# Altium project VM03_hv2.PrjPcb
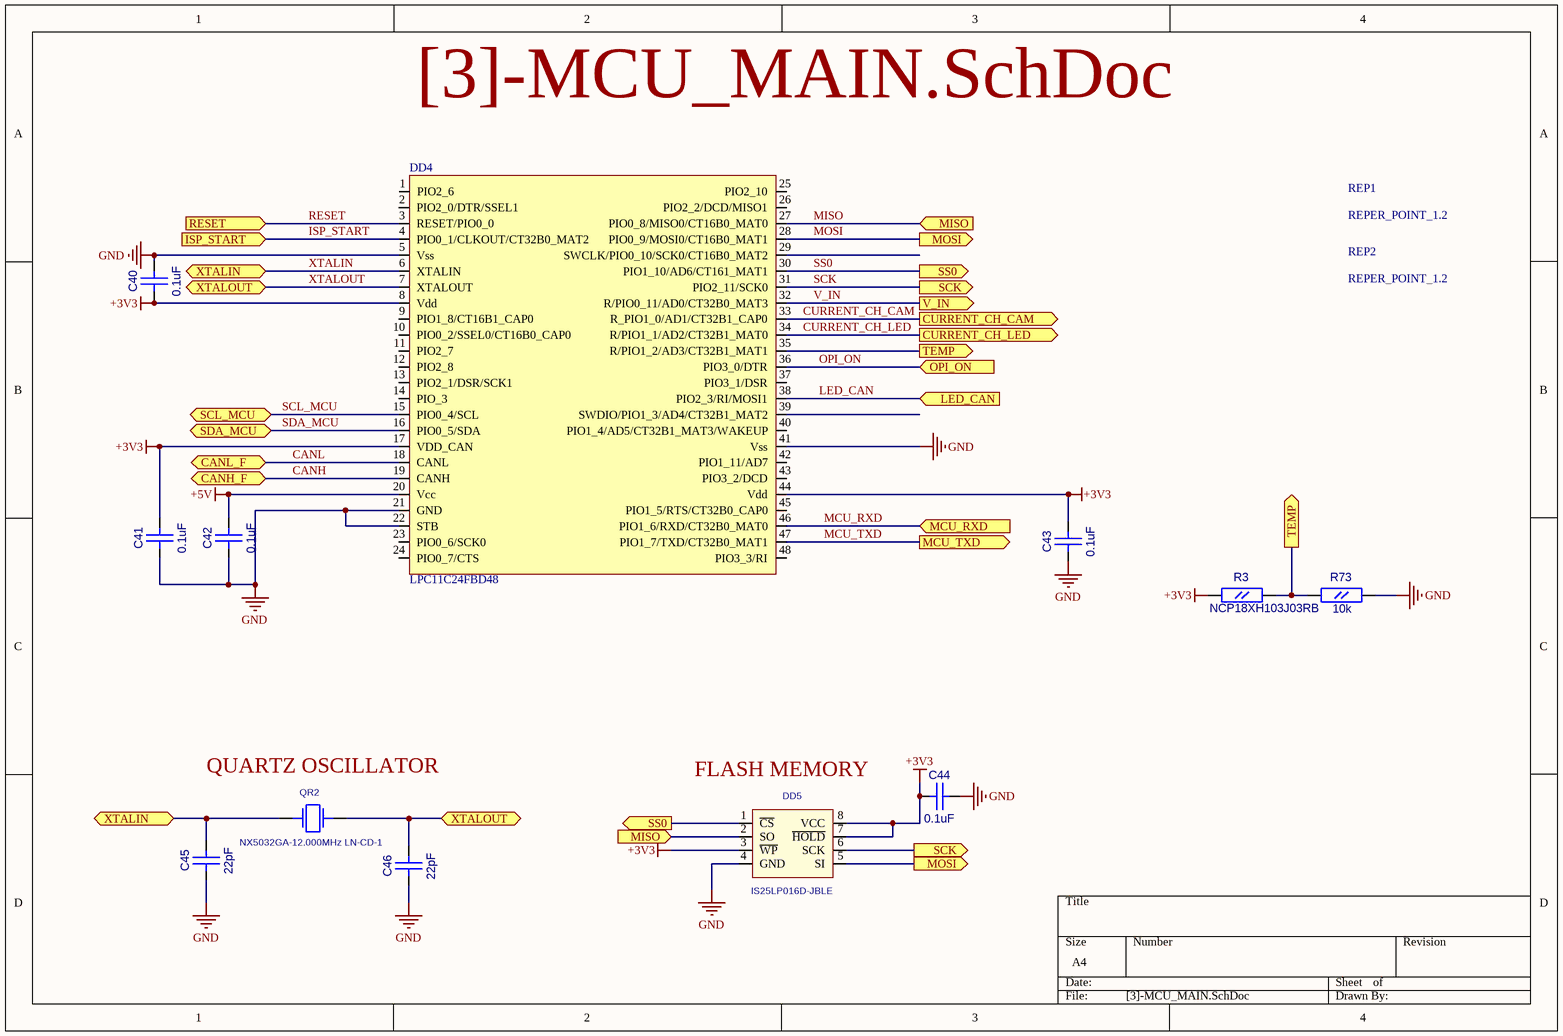
[diagram p0: [3]-MCU_MAIN.SchDoc]
13 sheets, 178 parts. Net scope: flat (ports and power ports of the same name join across sheets).
Board file: VM03_hv2.PcbDoc
Sheets:
  [3]-MCU_MAIN.SchDoc
  [5]-OPI_MAIN.SchDoc
  [6]-OPI_POWER.SchDoc
  [7]-GSM_MODEM_MAIN.SchDoc
  [8]-GSM_MODEM_CONNECTORS.SchDoc
  [9]-CAMERA_POWER_CONTROLLER.SchDoc
  [10]-MAIN_POWER.SchDoc
  [11]-MAIN_POWER2.SchDoc
  [11]-BATTERY_BACKUP.SchDoc
  [12]-MCU_INPUTS.SchDoc
  [14]-MAIN_CONNECTORS.SchDoc
  [15]-MCU_CONNECTORS.SchDoc
  [16]-CLOCK.SchDoc

## Sheet [3]-MCU_MAIN.SchDoc
size A4

### Parts
C40  0.1uF  [CC0603]
C41  0.1uF  [CC0603]
C42  0.1uF  [CC0603]
C43  0.1uF  [CC0603]
C44  0.1uF  [CC0603]
C45  22pF  [CC0603]
C46  22pF  [CC0603]
DD4  LPC11C24FBD48  [LQFP48]
DD5  IS25LP016D-JBLE  [EIAJ_SO8]
QR2  NX5032GA-12.000MHz LN-CD-1  [AC5032_2]
R3  NCP18XH103J03RB  [RC0603]
R73  10k  [RC0603]
REP1  REPER_POINT_1.2  [REPER1.2]
REP2  REPER_POINT_1.2  [REPER1.2]

### Ports
CANH_F (bidir), CANL_F (bidir), CURRENT_CH_CAM (out), CURRENT_CH_LED (out), ISP_START (in), LED_CAN (in), MCU_RXD (in), MCU_TXD (out), MISO (in), MOSI (out), OPI_ON (in), RESET (in), SCK (out), SCL_MCU (bidir), SDA_MCU (bidir), SS0 (out), TEMP (out), V_IN (out), XTALIN (bidir), XTALOUT (bidir)

### Nets
+3V3: C40.1(A) C41.2(B) C43.2(B) C44.1(A) DD4.8(Vdd) DD4.17(VDD_CAN) DD4.44(Vdd) DD5.3(~{WP}) DD5.7(~{HOLD}) DD5.8(VCC) R3.1(A)
+5V: C42.2(B) DD4.20(Vcc)
GND: C40.2(B) C41.1(A) C42.1(A) C43.1(A) C44.2(B) C45.1(A) C46.1(A) DD4.5(Vss) DD4.21(GND) DD4.22(STB) DD4.41(Vss) DD5.4(GND) R73.2(B)
CANH: DD4.19(CANH) ; port CANH_F
CANL: DD4.18(CANL) ; port CANL_F
CURRENT_CH_CAM: DD4.33(R_PIO1_0/AD1/CT32B1_CAP0) ; port CURRENT_CH_CAM
CURRENT_CH_LED: DD4.34(R/PIO1_1/AD2/CT32B1_MAT0) ; port CURRENT_CH_LED
ISP_START: DD4.4(PIO0_1/CLKOUT/CT32B0_MAT2) ; port ISP_START
LED_CAN: DD4.38(PIO2_3/RI/MOSI1) ; port LED_CAN
MCU_RXD: DD4.46(PIO1_6/RXD/CT32B0_MAT0) ; port MCU_RXD
MCU_TXD: DD4.47(PIO1_7/TXD/CT32B0_MAT1) ; port MCU_TXD
MISO: DD4.27(PIO0_8/MISO0/CT16B0_MAT0) DD5.2(SO) ; port MISO
MOSI: DD4.28(PIO0_9/MOSI0/CT16B0_MAT1) DD5.5(SI) ; port MOSI
OPI_ON: DD4.36(PIO3_0/DTR) ; port OPI_ON
RESET: DD4.3(RESET/PIO0_0) ; port RESET
SCK: DD4.31(PIO2_11/SCK0) DD5.6(SCK) ; port SCK
SCL_MCU: DD4.15(PIO0_4/SCL) ; port SCL_MCU
SDA_MCU: DD4.16(PIO0_5/SDA) ; port SDA_MCU
SS0: DD4.30(PIO1_10/AD6/CT161_MAT1) DD5.1(~{CS}) ; port SS0
V_IN: DD4.32(R/PIO0_11/AD0/CT32B0_MAT3) ; port V_IN
XTALIN: C45.2(B) DD4.6(XTALIN) QR2.1 ; port XTALIN
XTALOUT: C46.2(B) DD4.7(XTALOUT) QR2.2 ; port XTALOUT
NetDD4_35: DD4.35(R/PIO1_2/AD3/CT32B1_MAT1) R3.2(B) R73.1(A) ; port TEMP

Not connected (* = marked no-connect by the designer): DD4 1(PIO2_6) 2(PIO2_0/DTR/SSEL1) 9(PIO1_8/CT16B1_CAP0) 10(PIO0_2/SSEL0/CT16B0_CAP0) 11(PIO2_7) 12(PIO2_8) 13(PIO2_1/DSR/SCK1) 14(PIO_3) 23(PIO0_6/SCK0) 24(PIO0_7/CTS) 25(PIO2_10) 26(PIO2_2/DCD/MISO1) 29(SWCLK/PIO0_10/SCK0/CT16B0_MAT2) 37(PIO3_1/DSR) 39(SWDIO/PIO1_3/AD4/CT32B1_MAT2) 40(PIO1_4/AD5/CT32B1_MAT3/WAKEUP) 42(PIO1_11/AD7) 43(PIO3_2/DCD) 45(PIO1_5/RTS/CT32B0_CAP0) 48(PIO3_3/RI); REP1 1; REP2 1

### Notes on the sheet
- (near QR2) QUARTZ OSCILLATOR
- (near DD5) FLASH MEMORY

### Library data of the parts
C40-C46 = CC0603
  C40-C44: Value: 0.1uF
  C45 C46: Value: 22pF
DD5 = S25FL016A0LMFI01: Value: IS25LP016D-JBLE
QR2 = AC5032_2: AC5032/2; Value: NX5032GA-12.000MHz LN-CD-1
R3 R73 = RC0603
  R3: Value: NCP18XH103J03RB
  R73: Value: 10k
REP1 REP2 = REPER1.2: Value: REPER_POINT_1.2
DD4 = LPC11C24FBD48: Value: LPC11C24FBD48

## Sheet [5]-OPI_MAIN.SchDoc
size A4
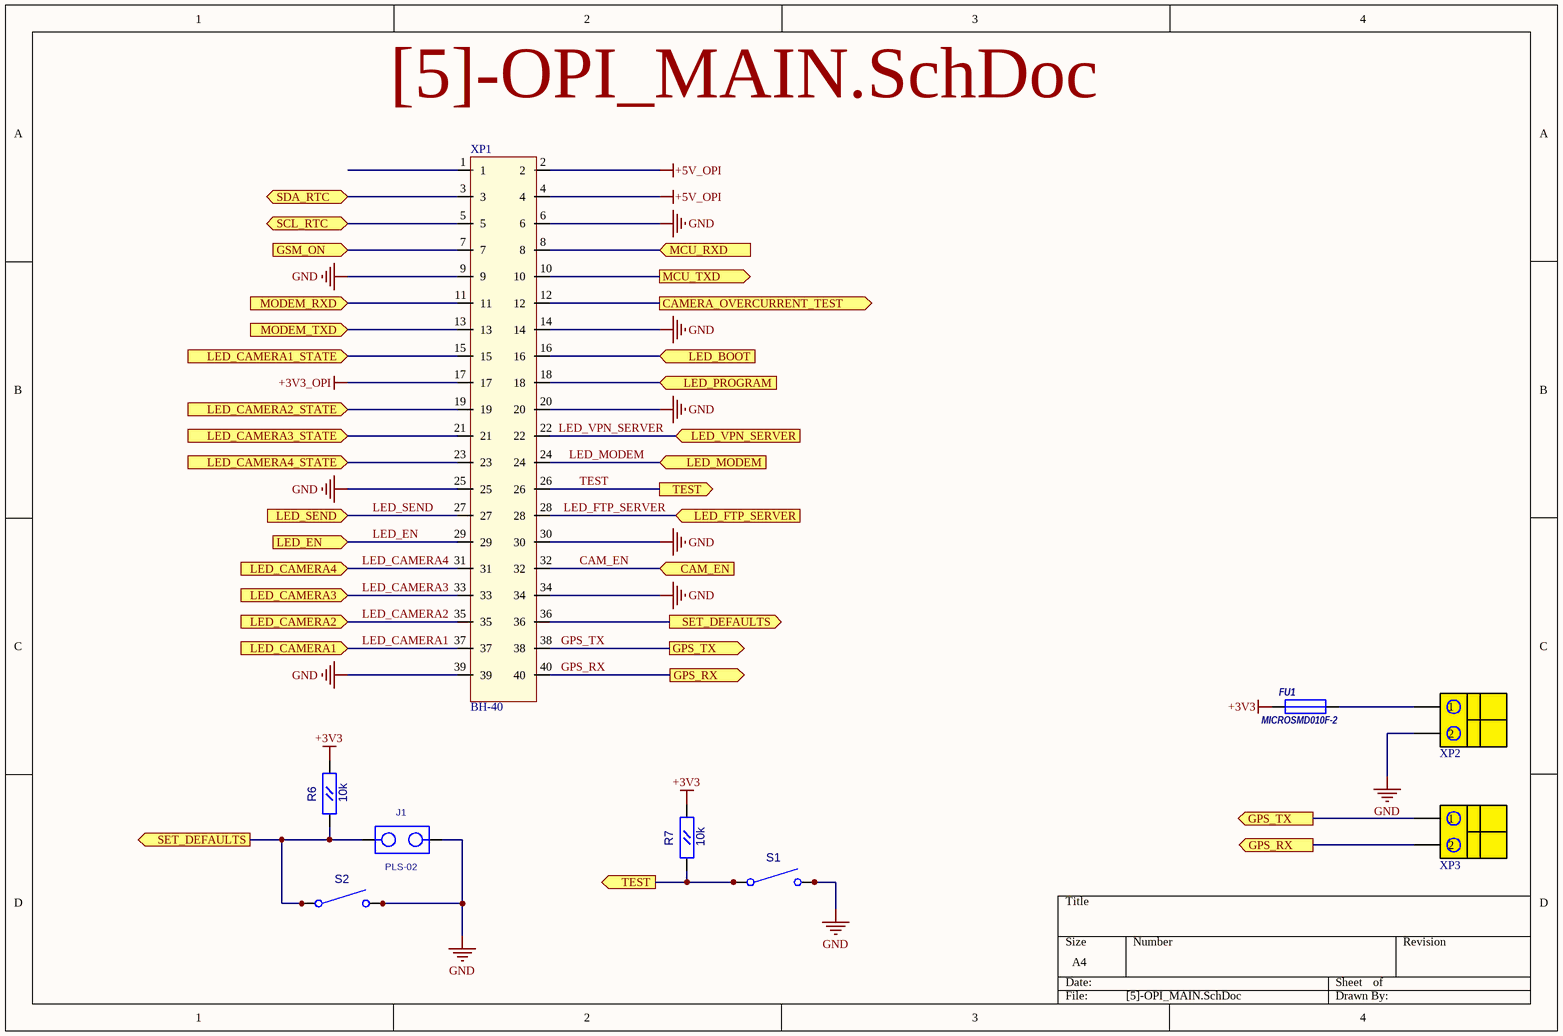
[diagram p1: [5]-OPI_MAIN.SchDoc]

### Parts
FU1  MICROSMD010F-2  [RC1210]
J1  PLS-02  [PLS-02]
R6  10k  [RC0603]
R7  10k  [RC0603]
S1  DTSM-61N  [DTSM-61N]  (value not drawn)
S2  DTSM-61N  [DTSM-61N]  (value not drawn)
XP1  BH-40  [BH-40]
XP2  DG330-2P  [DG330-2P]  (value not drawn)
XP3  DG330-2P  [DG330-2P]  (value not drawn)

### Ports
CAM_EN (in), CAMERA_OVERCURRENT_TEST (out), GPS_RX (out), GPS_TX (out), GSM_ON (in), LED_BOOT (in), LED_CAMERA1 (in), LED_CAMERA1_STATE (in), LED_CAMERA2 (in), LED_CAMERA2_STATE (in), LED_CAMERA3 (in), LED_CAMERA3_STATE (in), LED_CAMERA4 (in), LED_CAMERA4_STATE (in), LED_EN (in), LED_FTP_SERVER (in), LED_MODEM (in), LED_PROGRAM (in), LED_SEND (in), LED_VPN_SERVER (in), MCU_RXD (in), MCU_TXD (out), MODEM_RXD (in), MODEM_TXD (in), SCL_RTC (bidir), SDA_RTC (bidir), SET_DEFAULTS (out), TEST (out)

### Nets
+3V3: FU1.1 R6.2(B) R7.2(B)
+3V3_OPI: XP1.17
+5V_OPI: XP1.2 XP1.4
GND: J1.2 S1.3(C2) S1.4 S2.3(C2) S2.4 XP1.6 XP1.9 XP1.14 XP1.20 XP1.25 XP1.30 XP1.34 XP1.39 XP2.2
CAM_EN: XP1.32 ; port CAM_EN
GPS_RX: XP1.40 XP3.2 ; port GPS_RX
GPS_TX: XP1.38 XP3.1 ; port GPS_TX
LED_CAMERA1: XP1.37 ; port LED_CAMERA1
LED_CAMERA2: XP1.35 ; port LED_CAMERA2
LED_CAMERA3: XP1.33 ; port LED_CAMERA3
LED_CAMERA4: XP1.31 ; port LED_CAMERA4
LED_EN: XP1.29 ; port LED_EN
LED_FTP_SERVER: XP1.28 ; port LED_FTP_SERVER
LED_MODEM: XP1.24 ; port LED_MODEM
LED_SEND: XP1.27 ; port LED_SEND
LED_VPN_SERVER: XP1.22 ; port LED_VPN_SERVER
MCU_RXD: XP1.8 ; port MCU_RXD
MCU_TXD: XP1.10 ; port MCU_TXD
RXD: XP1.11 ; port MODEM_RXD
TEST: R7.1(A) S1.1(C1) S1.2 XP1.26 ; port TEST
TXD: XP1.13 ; port MODEM_TXD
NetC56_2: XP1.12 ; port CAMERA_OVERCURRENT_TEST
NetDD?_5: XP1.3 ; port SDA_RTC
NetDD?_6: XP1.5 ; port SCL_RTC
NetFU1_2: FU1.2 XP2.1
NetJ1_1: J1.1 R6.1(A) S2.1(C1) S2.2 XP1.36 ; port SET_DEFAULTS
NetR15_2: XP1.7 ; port GSM_ON
NetXP1_15: XP1.15 ; port LED_CAMERA1_STATE
NetXP1_16: XP1.16 ; port LED_BOOT
NetXP1_18: XP1.18 ; port LED_PROGRAM
NetXP1_19: XP1.19 ; port LED_CAMERA2_STATE
NetXP1_21: XP1.21 ; port LED_CAMERA3_STATE
NetXP1_23: XP1.23 ; port LED_CAMERA4_STATE

Not connected (* = marked no-connect by the designer): XP1 1

### Library data of the parts
FU1 = MICROSMD: Value: *
R6 R7 = RC0603: Value: 10k
S1 S2 = DTSM-61N: Switch, Single Pole, Single Throw, Normally Open; Value: {Value}
XP1 = BH-40: 2.54mm connector with key; Value: BH-40
XP2 XP3 = DG330-2P: Degson 2 pin connector rear; Value: DG330-2P
J1 = PLS-02: Value: *

## Sheet [6]-OPI_POWER.SchDoc
size A4
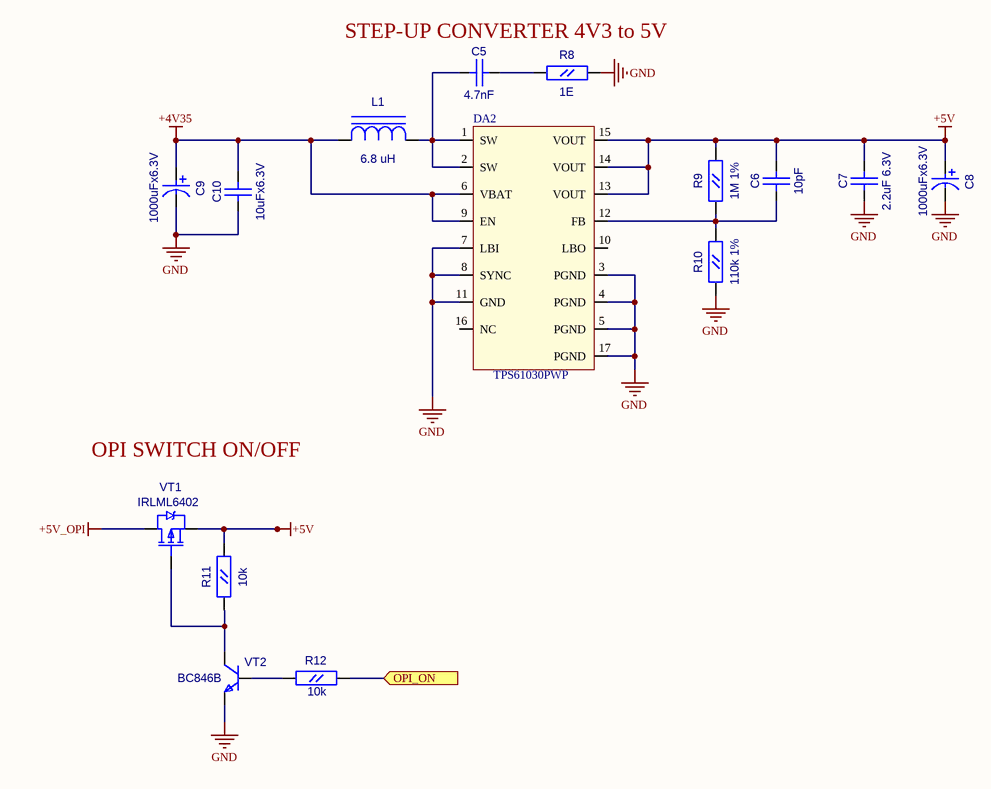
[diagram p2: [6]-OPI_POWER.SchDoc]

### Parts
C5  4.7nF  [CC0603]
C6  10pF  [CC0603]
C7  2.2uF 6.3V  [CC0805]
C8  value 1000uFx6.3V  [CC8X3.5]  (hidden comment: CAP0.35)
C9  value 1000uFx6.3V  [CC8X3.5]  (hidden comment: CAP0.35)
C10  10uFx6.3V  [CC0805]
DA2  TPS61030PWP  [R-PDSO-G16]
L1  6.8 uH  [SDR0805]
R8  1E  [RC0603]
R9  1M 1%  [RC0603]
R10  110k 1%  [RC0603]
R11  10k  [RC0603]
R12  10k  [RC0603]
VT1  IRLML6402  [SOT-23(123)]
VT2  BC846B  [SOT-23(123)]

### Ports
OPI_ON (in)

### Nets
+4V35: C9.1 C10.2(B) DA2.6(VBAT) DA2.9(EN) L1.1(C)
+5V: C6.2(B) C7.2(B) C8.1 DA2.13(VOUT) DA2.14(VOUT) DA2.15(VOUT) R9.2(B) R11.2(B) VT1.2(S)
+5V_OPI: VT1.3(D)
GND: C7.1(A) C8.2 C9.2 C10.1(A) DA2.3(PGND) DA2.4(PGND) DA2.5(PGND) DA2.7(LBI) DA2.8(SYNC) DA2.11(GND) DA2.17(PGND) R8.2(B) R10.1(A) VT2.2(E)
OPI_ON: R12.2(B) ; port OPI_ON
NetC5_1: C5.1(A) DA2.1(SW) DA2.2(SW) L1.2(A)
NetC5_2: C5.2(B) R8.1(A)
NetC6_1: C6.1(A) DA2.12(FB) R9.1(A) R10.2(B)
NetR11_1: R11.1(A) VT1.1(G) VT2.3(C)
NetR12_1: R12.1(A) VT2.1(B)

Not connected (* = marked no-connect by the designer): DA2 10(LBO) 16(NC)

### Notes on the sheet
- STEP-UP CONVERTER 4V3 to 5V
- OPI SWITCH ON/OFF

### Library data of the parts
C5 C6 = CC0603
  C5: Value: 4.7nF
  C6: Value: 10pF
C7 C10 = CC0805
  C7: Value: 2.2uF 6.3V
  C10: Value: 10uFx6.3V
DA2 = TPS61030PWP: Boost converter
L1 = SDR0805: Value: 6.8 uH
R8-R12 = RC0603
  R8: Value: 1E
  R9: Value: 1M 1%
  R10: Value: 110k 1%
  R11 R12: Value: 10k
VT1 = IRLML6402: HEXFET Power MOSFET; OriginalName: IRLML5103; ComponentField7: Published 8-Jun-2000; Value: IRLML6402
VT2 = BC846BLT1: ComponentField7: Published 29-Sep-2000; OriginalName: BC846BLT1; Value: BC846B

## Sheet [7]-GSM_MODEM_MAIN.SchDoc
size A4
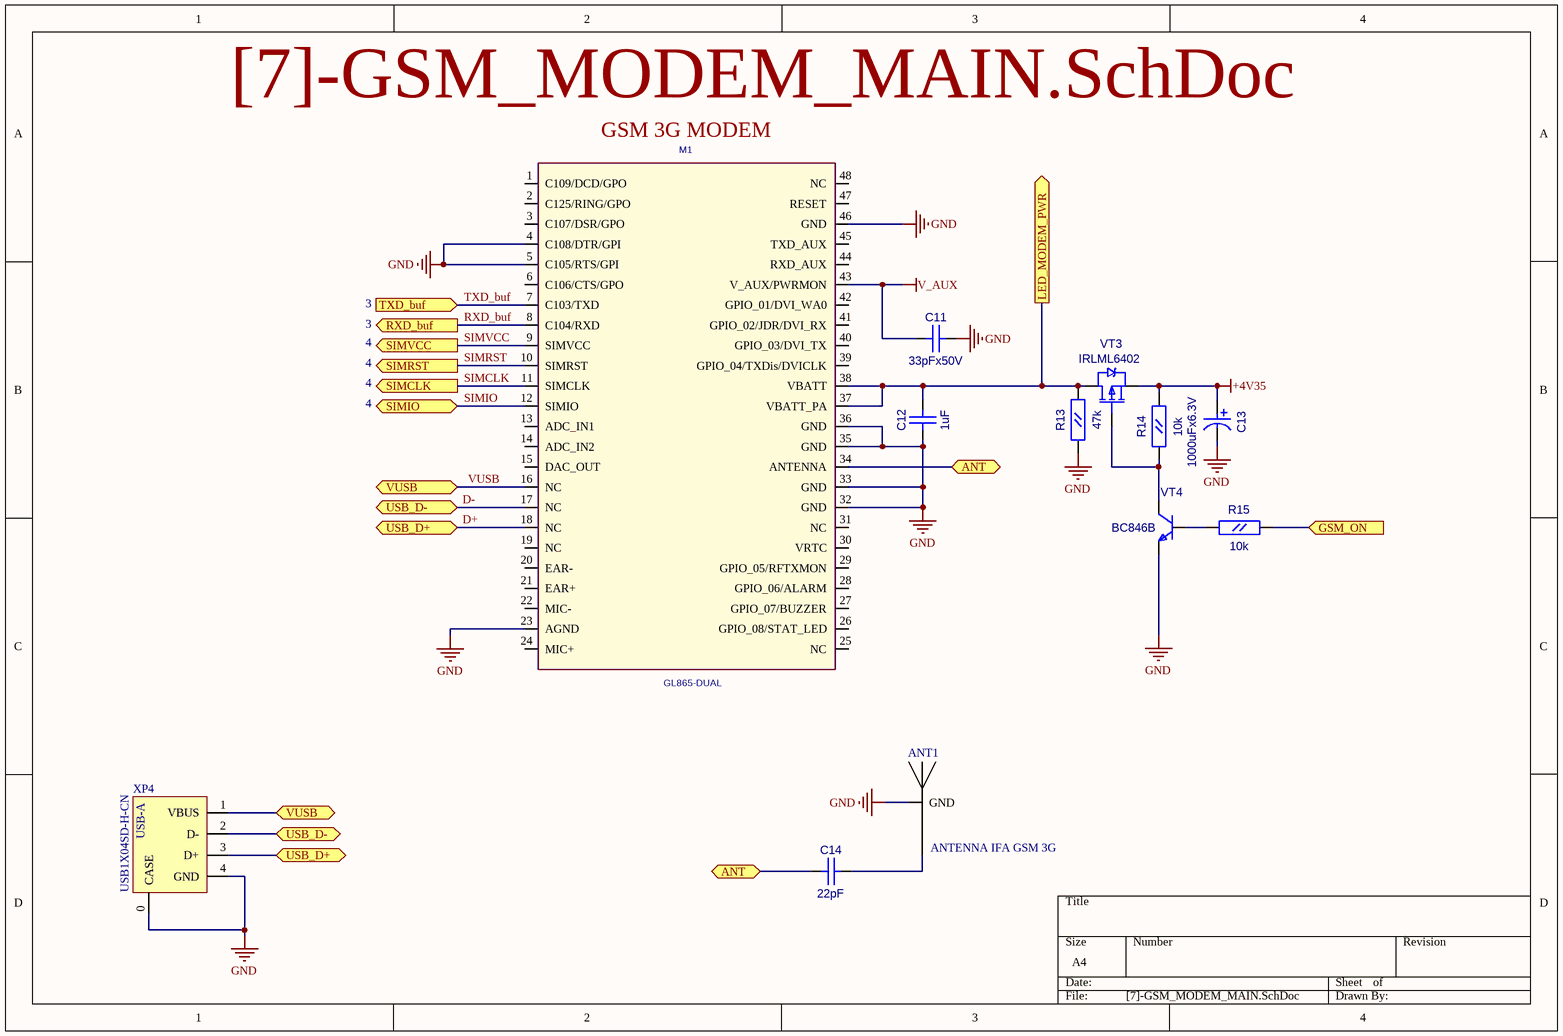
[diagram p3: [7]-GSM_MODEM_MAIN.SchDoc]

### Parts
ANT1  ANTENNA IFA GSM 3G  [IFA_GSM_3G]
C11  33pFx50V  [CC0603]
C12  1uF  [CC0603]
C13  value 1000uFx6.3V  [CC8X3.5]  (hidden comment: CAP0.35)
C14  22pF  [CC0603]
M1  GL865-DUAL  [GL868-DUAL]
R13  47k  [RC0603]
R14  10k  [RC0603]
R15  10k  [RC0603]
VT3  IRLML6402  [SOT-23(123)]
VT4  BC846B  [SOT-23(123)]
XP4  USB1X04SD-H-CN  [USB_A_FRONT]

### Ports
ANT (bidir), GSM_ON (in), LED_MODEM_PWR (out), RXD_buf (out), SIMCLK (out), SIMIO (bidir), SIMRST (out), SIMVCC (out), TXD_buf (in), USB_D+ (bidir), USB_D- (bidir), VUSB (bidir)

### Nets
+4V35: C13.1 R14.2(B) VT3.2(S)
GND: ANT1.2(GND) C11.2(B) C12.1(A) C13.2 M1.4(C108/DTR/GPI) M1.5(C105/RTS/GPI) M1.23(AGND) M1.32(GND) M1.33(GND) M1.35(GND) M1.36(GND) M1.46(GND) R13.1(A) VT4.2(E) XP4.0(CASE) XP4.4(GND)
V_AUX: C11.1(A) M1.43(V_AUX/PWRMON)
D+: M1.18(NC) XP4.3(D+) ; port USB_D+
D-: M1.17(NC) XP4.2(D-) ; port USB_D-
RXD_buf: M1.8(C104/RXD) ; port RXD_buf
SIMCLK: M1.11(SIMCLK) ; port SIMCLK
SIMIO: M1.12(SIMIO) ; port SIMIO
SIMRST: M1.10(SIMRST) ; port SIMRST
SIMVCC: M1.9(SIMVCC) ; port SIMVCC
TXD_buf: M1.7(C103/TXD) ; port TXD_buf
VUSB: M1.16(NC) XP4.1(VBUS) ; port VUSB
NetANT1_1: ANT1.1(RF_IN) C14.2(B)
NetC12_2: C12.2(B) M1.37(VBATT_PA) M1.38(VBATT) R13.2(B) VT3.3(D) ; port LED_MODEM_PWR
NetC14_1: C14.1(A) M1.34(ANTENNA) ; port ANT
NetR14_1: R14.1(A) VT3.1(G) VT4.3(C)
NetR15_1: R15.1(A) VT4.1(B)
NetR15_2: R15.2(B) ; port GSM_ON

Not connected (* = marked no-connect by the designer): M1 1(C109/DCD/GPO) 2(C125/RING/GPO) 3(C107/DSR/GPO) 6(C106/CTS/GPO) 13(ADC_IN1) 14(ADC_IN2) 15(DAC_OUT) 19(NC) 20(EAR-) 21(EAR+) 22(MIC-) 24(MIC+) 25(NC) 26(GPIO_08/STAT_LED) 27(GPIO_07/BUZZER) 28(GPIO_06/ALARM) 29(GPIO_05/RFTXMON) 30(VRTC) 31(NC) 39(GPIO_04/TXDis/DVICLK) 40(GPIO_03/DVI_TX) 41(GPIO_02/JDR/DVI_RX) 42(GPIO_01/DVI_WA0) 44(RXD_AUX) 45(TXD_AUX) 47(RESET) 48(NC)

### Notes on the sheet
- (near M1) GSM 3G MODEM
- 3
- 4
- (in symbol USB_A_VERTICAL) USB-A

### Library data of the parts
ANT1 = ANTENNA_IFA_GSM_3G: 1.6mm Er=4.4
C11 C12 C14 = CC0603
  C11: Value: 33pFx50V
  C12: Value: 1uF
  C14: Value: 22pF
M1 = GL868-DUAL: Value: *
R13-R15 = RC0603
  R13: Value: 47k
  R14 R15: Value: 10k
VT3 = IRLML6402: as VT1 on sheet [6]-OPI_POWER; Value: IRLML6402
VT4 = BC846BLT1: ComponentField7: Published 29-Sep-2000; OriginalName: BC846BLT1; Value: BC846B
XP4 = USB_A_VERTICAL: Vertical USB connetctor,type A.THR; Value: USB1X04SD-H-CN

## Sheet [8]-GSM_MODEM_CONNECTORS.SchDoc
size A4
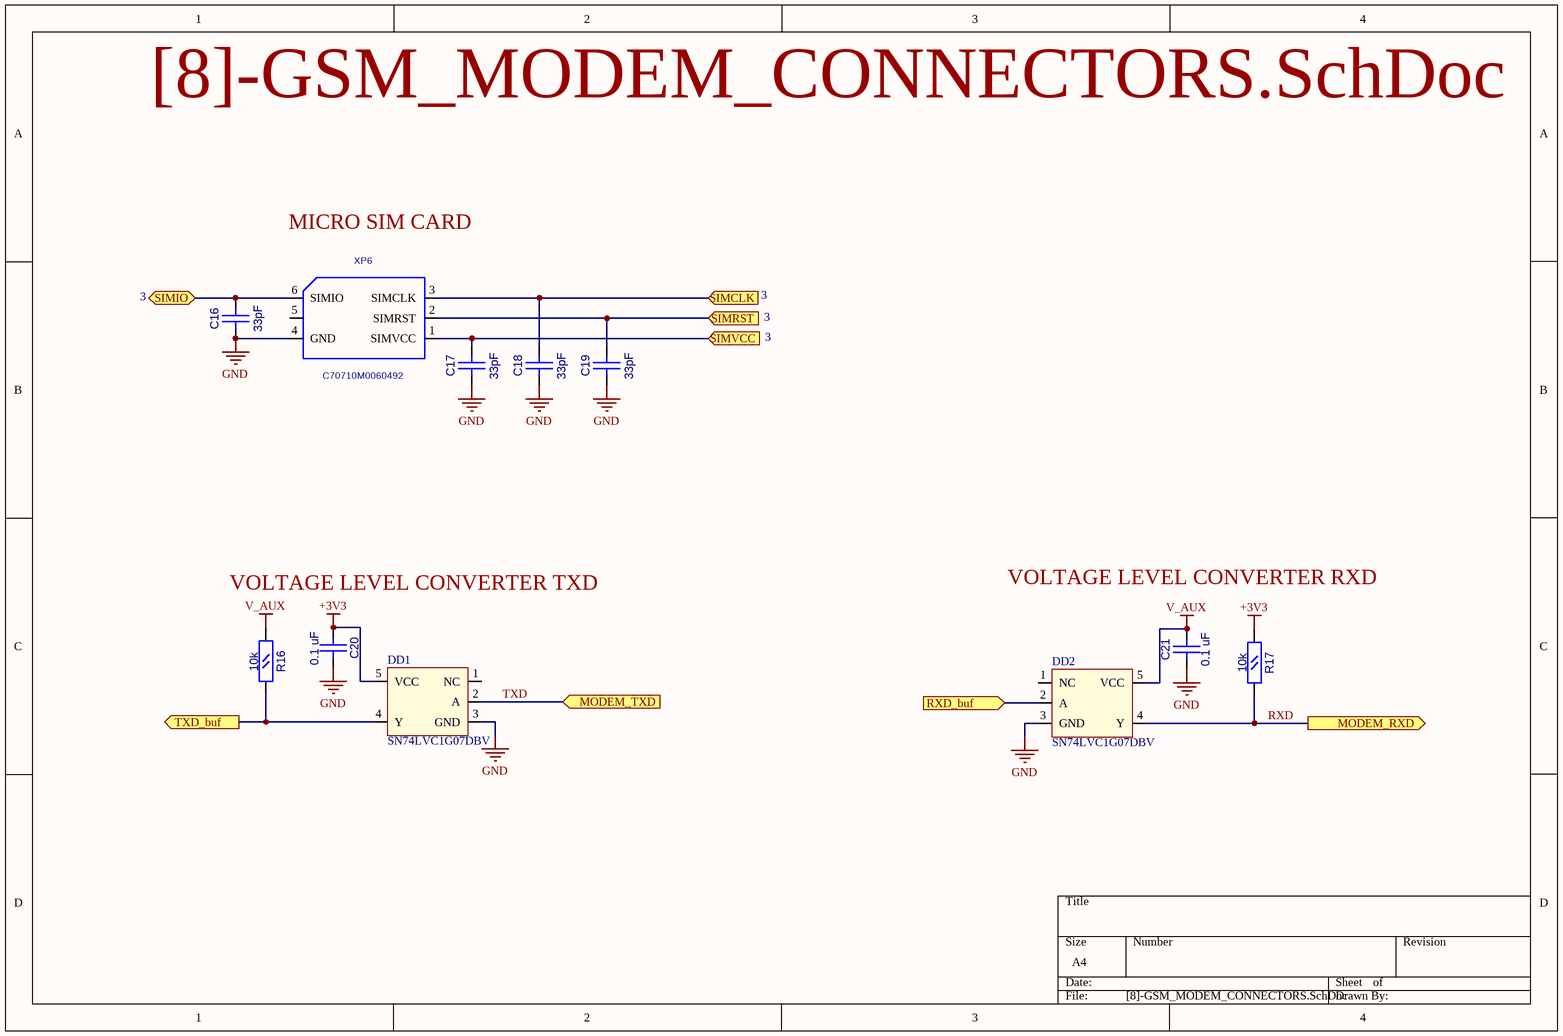
[diagram p4: [8]-GSM_MODEM_CONNECTORS.SchDoc]

### Parts
C16  33pF  [CC0603]
C17  33pF  [CC0603]
C18  33pF  [CC0603]
C19  33pF  [CC0603]
C20  0.1 uF  [CC0603]
C21  0.1 uF  [CC0603]
DD1  SN74LVC1G07DBV  [SOT23-5]
DD2  SN74LVC1G07DBV  [SOT23-5]
R16  10k  [RC0603]
R17  10k  [RC0603]
XP6  C70710M0060492  [SCVW06A25020]

### Ports
MODEM_RXD (out), MODEM_TXD (in), RXD_buf (in), SIMCLK (in), SIMIO (bidir), SIMRST (in), SIMVCC (in), TXD_buf (out)

### Nets
+3V3: C20.2(B) DD1.5(VCC) R17.1(A)
GND: C16.1(A) C17.1(A) C18.1(A) C19.1(A) C20.1(A) C21.1(A) DD1.3(GND) DD2.3(GND) XP6.4(GND)
V_AUX: C21.2(B) DD2.5(VCC) R16.1(A)
RXD: DD2.4(Y) R17.2(B) ; port MODEM_RXD
RXD_buf: DD2.2(A) ; port RXD_buf
SIMCLK: C18.2(B) XP6.3(SIMCLK) ; port SIMCLK
SIMIO: C16.2(B) XP6.6(SIMIO) ; port SIMIO
SIMRST: C19.2(B) XP6.2(SIMRST) ; port SIMRST
SIMVCC: C17.2(B) XP6.1(SIMVCC) ; port SIMVCC
TXD: DD1.2(A) ; port MODEM_TXD
TXD_buf: DD1.4(Y) R16.2(B) ; port TXD_buf

Not connected (* = marked no-connect by the designer): DD1 1(NC); DD2 1(NC); XP6 5

### Notes on the sheet
- MICRO SIM CARD
- 3
- VOLTAGE LEVEL CONVERTER RXD
- VOLTAGE LEVEL CONVERTER TXD

### Library data of the parts
C16-C21 = CC0603
  C16-C19: Value: 33pF
  C20 C21: Value: 0.1 uF
DD1 DD2 = SN74LVC1G07DBV: Open Drain Single Bus Bufer
R16 R17 = RC0603: Value: 10k
XP6 = SCV-W06A25-020: Value: *

## Sheet [9]-CAMERA_POWER_CONTROLLER.SchDoc
size A4
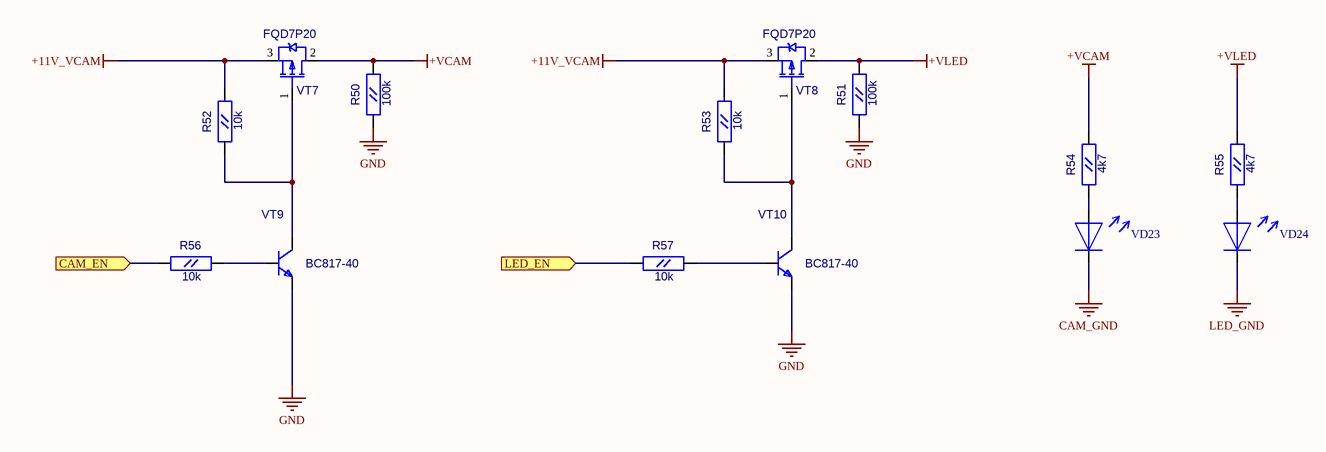
[diagram p5: [9]-CAMERA_POWER_CONTROLLER.SchDoc]

### Parts
R50  100k  [RC0603]
R51  100k  [RC0603]
R52  10k  [RC0603]
R53  10k  [RC0603]
R54  4k7  [RC0603]
R55  4k7  [RC0603]
R56  10k  [RC0603]
R57  10k  [RC0603]
VD23  LED_0805  [LED0805]  (value not drawn)
VD24  LED_0805  [LED0805]  (value not drawn)
VT7  FQD7P20  [D-PAK(TO-252AA)]
VT8  FQD7P20  [D-PAK(TO-252AA)]
VT9  BC817-40  [SOT-23(123)]
VT10  BC817-40  [SOT-23(123)]

### Ports
CAM_EN (in), LED_EN (in)

### Nets
+11V_VCAM: R52.2(B) R53.2(B) VT7.3(S) VT8.3(S)
+VCAM: R50.2(B) R54.2(B) VT7.2(D)
+VLED: R51.2(B) R55.2(B) VT8.2(D)
CAM_GND: VD23.2
GND: R50.1(A) R51.1(A) VT9.2(E) VT10.2(E)
LED_GND: VD24.2
CAM_EN: R56.1(A) ; port CAM_EN
LED_EN: R57.1(A) ; port LED_EN
NetR52_1: R52.1(A) VT7.1(G) VT9.3(C)
NetR53_1: R53.1(A) VT8.1(G) VT10.3(C)
NetR54_1: R54.1(A) VD23.1
NetR55_1: R55.1(A) VD24.1
NetR56_2: R56.2(B) VT9.1(B)
NetR57_2: R57.2(B) VT10.1(B)

### Library data of the parts
R50-R57 = RC0603
  R50 R51: Value: 100k
  R52 R53 R56 R57: Value: 10k
  R54 R55: Value: 4k7
VT7 VT8 = IRFR9220: HEXFET Power MOSFET; OriginalName: IRLML5103; ComponentField7: Published 8-Jun-2000; Value: FQD7P20
VT9 VT10 = BC846BLT1: NPN 500ma transistor; ComponentField7: Published 29-Sep-2000; OriginalName: BC846BLT1; Value: BC817-40
VD23 VD24 = LED_0805: Value: LED_0805

## Sheet [10]-MAIN_POWER.SchDoc
size A4
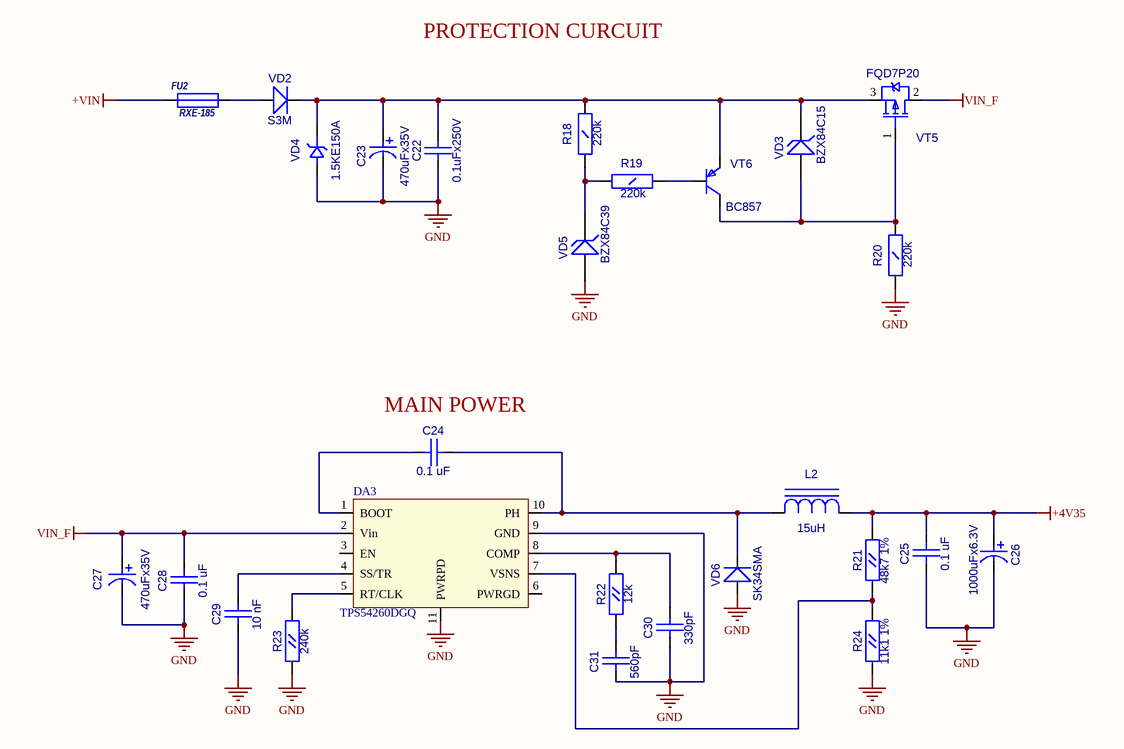
[diagram p6: [10]-MAIN_POWER.SchDoc]

### Parts
C22  0.1uFx250V  [CC1206]
C23  value 470uFx35V  [CC16X10_CAP0.5(1)(Primary)]  (hidden comment: CAP0.5(1))
C24  0.1 uF  [CC0603]
C25  0.1 uF  [CC0603]
C26  1000uFx6.3V  [CC8X3.5]
C27  470uFx35V  [CC16X10_CAP0.5(1)(Primary)]
C28  0.1 uF  [CC0603]
C29  10 nF  [CC0603]
C30  330pF  [CC0603]
C31  560pF  [CC0603]
DA3  TPS54260DGQ  [S-PDSO-G10]
FU2  RXE-185  [RXE-185]
L2  15uH  [SDR0805]
R18  220k  [RC1206]
R19  220k  [RC1206]
R20  220k  [RC1206]
R21  48k7 1%  [RC0603]
R22  12k  [RC0603]
R23  240k  [RC0603]
R24  11k1 1%  [RC0603]
VD2  S3M  [SMC]
VD3  BZX84C15  [SOT-23(123)]
VD4  1.5KE150A  [DO-201]
VD5  BZX84C39  [SOT-23(123)]
VD6  SK34SMA  [SMA]
VT5  FQD7P20  [D-PAK(TO-252AA)]
VT6  BC857  [SOT-23(123)]

### Nets
+4V35: C25.1(A) C26.1 L2.2(A) R21.2(B)
+VIN: FU2.1
GND: C22.1(A) C23.1 C25.2(B) C26.2 C27.1 C28.2(B) C29.2(B) C30.2(B) C31.2(B) DA3.9(GND) DA3.11(PWRPD) R20.1(A) R23.1(A) R24.1(A) VD4.1(A) VD5.1(A) VD6.1(A)
VIN_F: C27.2 C28.1(A) DA3.2(Vin) VT5.2(D)
NetC22_2: C22.2(B) C23.2 R18.2(B) VD2.2(K) VD3.3(K) VD4.2(K) VT5.3(S) VT6.2(E)
NetC24_1: C24.1(A) DA3.10(PH) L2.1(C) VD6.2(K)
NetC24_2: C24.2(B) DA3.1(BOOT)
NetC29_1: C29.1(A) DA3.4(SS/TR)
NetC30_1: C30.1(A) DA3.8(COMP) R22.2(B)
NetC31_1: C31.1(A) R22.1(A)
NetDA3_5: DA3.5(RT/CLK) R23.2(B)
NetDA3_7: DA3.7(VSNS) R21.1(A) R24.2(B)
NetFU2_2: FU2.2 VD2.1(A)
NetR18_1: R18.1(A) R19.1(A) VD5.3(K)
NetR19_2: R19.2(B) VT6.1(B)
NetR20_2: R20.2(B) VD3.1(A) VT5.1(G) VT6.3(C)

Not connected (* = marked no-connect by the designer): DA3 3(EN) 6(PWRGD)

### Notes on the sheet
- PROTECTION CURCUIT
- (near C24) MAIN POWER

### Library data of the parts
C22 = CC1206: Value: 0.1uFx250V
C24 C25 C28-C31 = CC0603
  C24 C25 C28: Value: 0.1 uF
  C29: Value: 10 nF
  C30: Value: 330pF
  C31: Value: 560pF
C26 = CAP0.35: Value: 1000uFx6.3V
C27 = CAP0.5(1): Value: 470uFx35V
L2 = SDR0805: Value: 15uH
R18-R20 = RC1206: Value: 220k
R21-R24 = RC0603
  R21: Value: 48k7 1%
  R22: Value: 12k
  R23: Value: 240k
  R24: Value: 11k1 1%
VD2 = S3A: Schottky Rectifier; Value: S3M
VD3 VD5 = BZX84: Zener Voltage Regulator Diode
  VD3: Value: BZX84C15
  VD5: Value: BZX84C39
VD4 = 1.5KE: Value: 1.5KE150A
VD6 = SK34SMA: Schottky Rectifier; Value: {Value}
VT5 = IRFR9220: as VT7 on sheet [9]-CAMERA_POWER_CONTROLLER; Value: FQD7P20
VT6 = BC857B: PNP 100ma transistor; OriginalName: BC846BLT1; ComponentField7: Published 29-Sep-2000; Value: BC857
FU2 = RXE-185: Value: *

## Sheet [11]-MAIN_POWER2.SchDoc
size A4
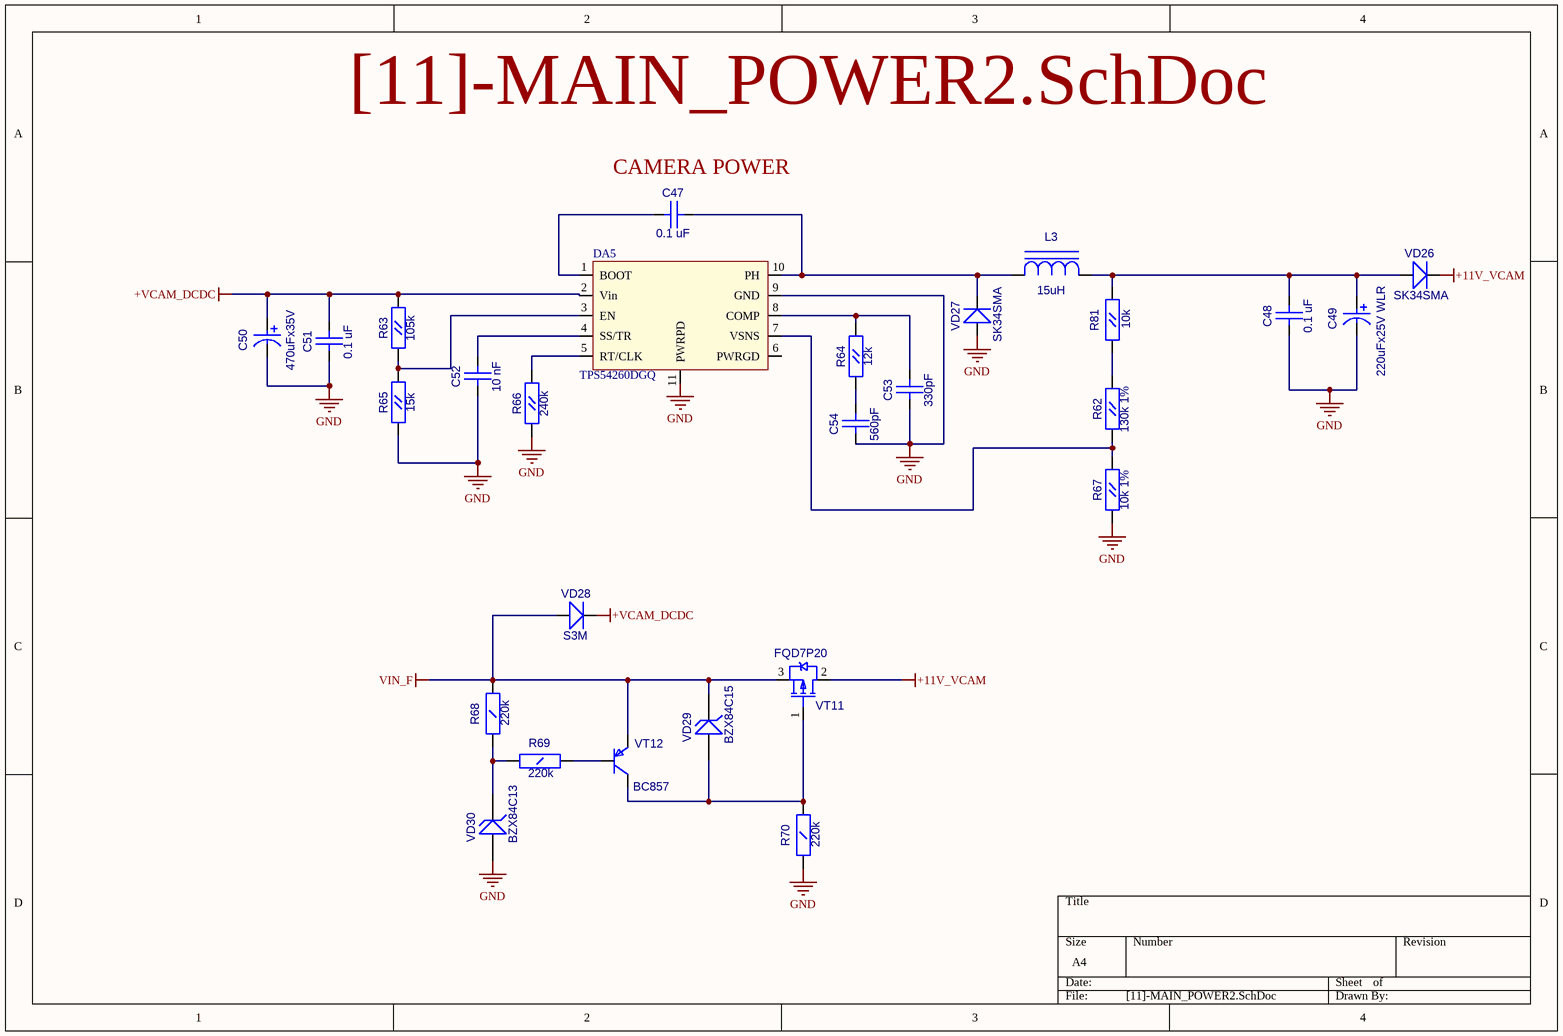
[diagram p7: [11]-MAIN_POWER2.SchDoc]

### Parts
C47  0.1 uF  [CC0603]
C48  0.1 uF  [CC0603]
C49  220uFx25V WLR  [CC8X3.5]
C50  470uFx35V  [CC16X10_CAP0.5(1)(Primary)]
C51  0.1 uF  [CC0603]
C52  10 nF  [CC0603]
C53  330pF  [CC0603]
C54  560pF  [CC0603]
DA5  TPS54260DGQ  [S-PDSO-G10]
L3  15uH  [SDR0805]
R62  130k 1%  [RC0603]
R63  105k  [RC0603]
R64  12k  [RC0603]
R65  15k  [RC0603]
R66  240k  [RC0603]
R67  10k 1%  [RC0603]
R68  220k  [RC1206]
R69  220k  [RC1206]
R70  220k  [RC1206]
R81  10k  [RC0603]
VD26  SK34SMA  [SMA]
VD27  SK34SMA  [SMA]
VD28  S3M  [SMC]
VD29  BZX84C15  [SOT-23(123)]
VD30  BZX84C13  [SOT-23(123)]
VT11  FQD7P20  [D-PAK(TO-252AA)]
VT12  BC857  [SOT-23(123)]

### Nets
+11V_VCAM: VD26.2(K) VT11.2(D)
+VCAM_DCDC: C50.2 C51.1(A) DA5.2(Vin) R63.2(B) VD28.2(K)
GND: C48.2(B) C49.2 C50.1 C51.2(B) C52.2(B) C53.2(B) C54.2(B) DA5.9(GND) DA5.11(PWRPD) R65.1(A) R66.1(A) R67.1(A) R70.1(A) VD27.1(A) VD30.1(A)
VIN_F: R68.2(B) VD28.1(A) VD29.3(K) VT11.3(S) VT12.2(E)
NetC47_1: C47.1(A) DA5.10(PH) L3.1(C) VD27.2(K)
NetC47_2: C47.2(B) DA5.1(BOOT)
NetC48_1: C48.1(A) C49.1 L3.2(A) R81.2(B) VD26.1(A)
NetC52_1: C52.1(A) DA5.4(SS/TR)
NetC53_1: C53.1(A) DA5.8(COMP) R64.2(B)
NetC54_1: C54.1(A) R64.1(A)
NetDA5_3: DA5.3(EN) R63.1(A) R65.2(B)
NetDA5_5: DA5.5(RT/CLK) R66.2(B)
NetDA5_7: DA5.7(VSNS) R62.1(A) R67.2(B)
NetR62_2: R62.2(B) R81.1(A)
NetR68_1: R68.1(A) R69.1(A) VD30.3(K)
NetR69_2: R69.2(B) VT12.1(B)
NetR70_2: R70.2(B) VD29.1(A) VT11.1(G) VT12.3(C)

Not connected (* = marked no-connect by the designer): DA5 6(PWRGD)

### Notes on the sheet
- (near C47) CAMERA POWER

### Library data of the parts
C47 C48 C51-C54 = CC0603
  C47 C48 C51: Value: 0.1 uF
  C52: Value: 10 nF
  C53: Value: 330pF
  C54: Value: 560pF
C49 = CAP0.35: Value: 220uFx25V WLR
C50 = CAP0.5(1): Value: 470uFx35V
L3 = SDR0805: Value: 15uH
R62-R67 R81 = RC0603
  R62: Value: 130k 1%
  R63: Value: 105k
  R64: Value: 12k
  R65: Value: 15k
  R66: Value: 240k
  R67: Value: 10k 1%
  R81: Value: 10k
R68-R70 = RC1206: Value: 220k
VD26 VD27 = SK34SMA: Schottky Rectifier; Value: {Value}
VD28 = S3A: Schottky Rectifier; Value: S3M
VD29 VD30 = BZX84: Zener Voltage Regulator Diode
  VD29: Value: BZX84C15
  VD30: Value: BZX84C13
VT11 = IRFR9220: as VT7 on sheet [9]-CAMERA_POWER_CONTROLLER; Value: FQD7P20
VT12 = BC857B: as VT6 on sheet [10]-MAIN_POWER; Value: BC857

## Sheet [11]-BATTERY_BACKUP.SchDoc
size A4
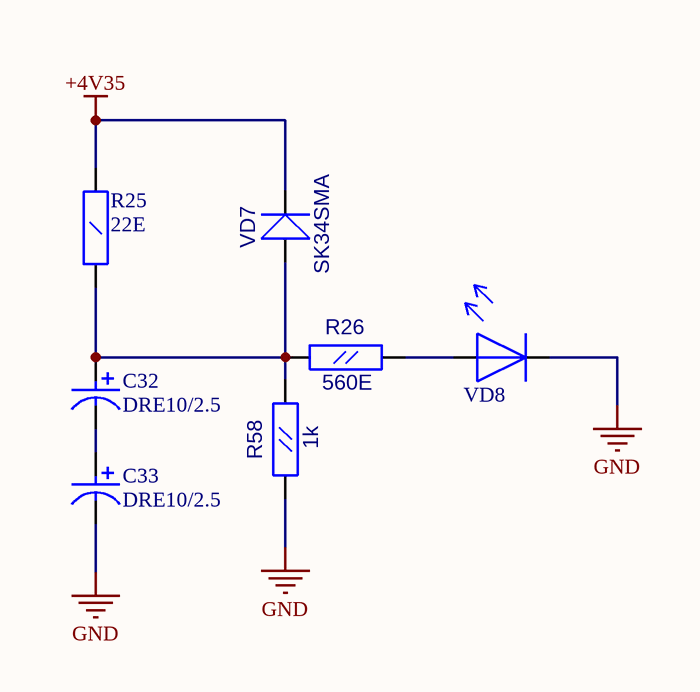
[diagram p8: [11]-BATTERY_BACKUP.SchDoc]

### Parts
C32  DRE10/2.5  [CAP_D12.5_H25]
C33  DRE10/2.5  [CAP_D12.5_H25]
R25  22E  [R2512]
R26  560E  [RC0603]
R58  1k  [RC0603]
VD7  SK34SMA  [SMA]
VD8  LED_0805  [LED0805]  (value not drawn)

### Nets
+4V35: R25.2(B) VD7.2(K)
GND: C33.1 R58.1(A) VD8.2
NetC32_1: C32.1 C33.2
NetC32_2: C32.2 R25.1(A) R26.1(A) R58.2(B) VD7.1(A)
NetR26_2: R26.2(B) VD8.1

### Library data of the parts
C32 C33 = SUPERCAP_10F: Value: DRE10/2.5
R25 = RC2512: Resistor 2512 1W; Value: 22E
R26 R58 = RC0603
  R26: Value: 560E
  R58: Value: 1k
VD7 = SK34SMA: Schottky Rectifier; Value: {Value}
VD8 = LED_0805: Value: LED_0805

## Sheet [12]-MCU_INPUTS.SchDoc
size A4
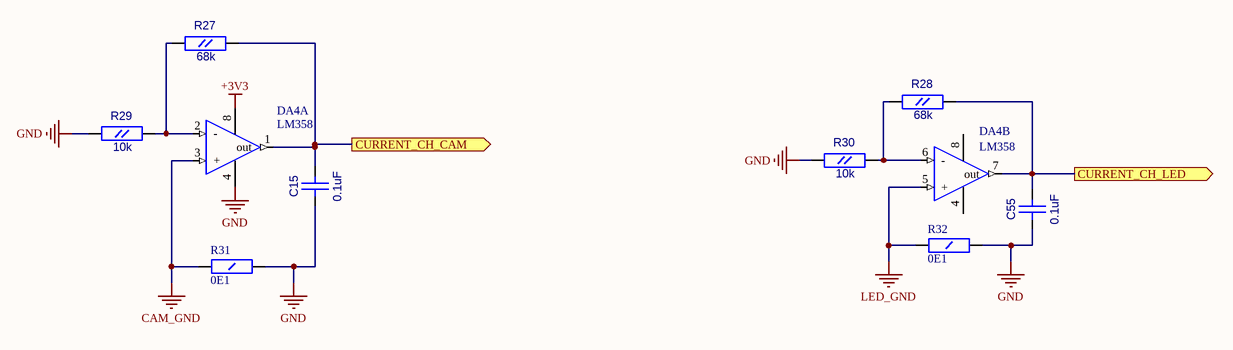
[diagram p9: [12]-MCU_INPUTS.SchDoc]

### Parts
C15  0.1uF  [CC0603]
C55  0.1uF  [CC0603]
DA4  LM358  [SO-8]  (parts A,B of 2)
R27  68k  [RC0603]
R28  68k  [RC0603]
R29  10k  [RC0603]
R30  10k  [RC0603]
R31  0E1  [R2512]
R32  0E1  [R2512]

### Ports
CURRENT_CH_CAM (out), CURRENT_CH_LED (out)

### Nets
+3V3: DA4.8(V+)
CAM_GND: DA4.3(+) R31.1(A)
GND: C15.1(A) C55.1(A) DA4.4(V-) R29.1(A) R30.1(A) R31.2(B) R32.2(B)
LED_GND: DA4.5(+) R32.1(A)
CURRENT_CH_CAM: C15.2(B) DA4.1(out) R27.2(B) ; port CURRENT_CH_CAM
CURRENT_CH_LED: C55.2(B) DA4.7(out) R28.2(B) ; port CURRENT_CH_LED
NetDA4_2: DA4.2(-) R27.1(A) R29.2(B)
NetDA4_6: DA4.6(-) R28.1(A) R30.2(B)

### Library data of the parts
C15 C55 = CC0603: Value: 0.1uF
R27-R30 = RC0603
  R27 R28: Value: 68k
  R29 R30: Value: 10k
R31 R32 = RC2512: Resistor 2512 1W; Value: 0E1
DA4 = lm358: Value: LM358

## Sheet [14]-MAIN_CONNECTORS.SchDoc
size A4
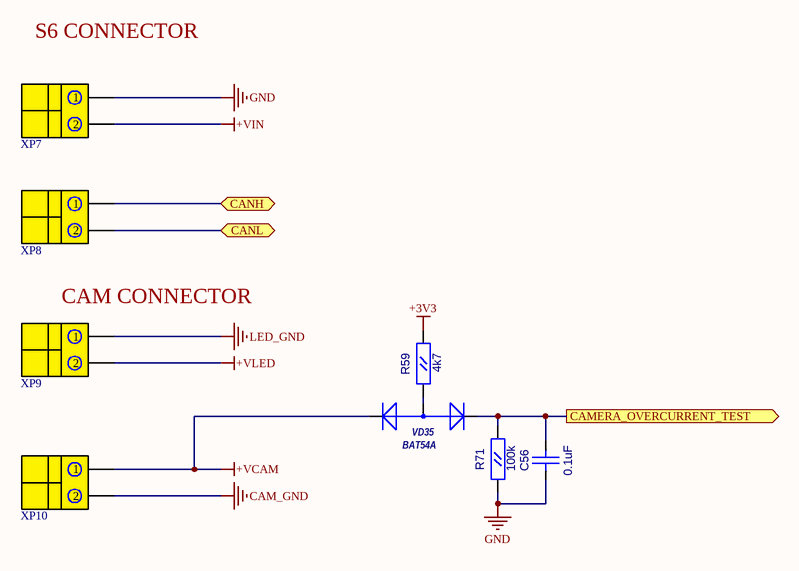
[diagram p10: [14]-MAIN_CONNECTORS.SchDoc]

### Parts
C56  0.1uF  [CC0603]
R59  4k7  [RC0603]
R71  100k  [RC0603]
VD35  BAT54A  [SOT-23(123)]
XP7  DG330-2P  [DG330-2P]  (value not drawn)
XP8  DG330-2P  [DG330-2P]  (value not drawn)
XP9  DG330-2P  [DG330-2P]  (value not drawn)
XP10  DG330-2P  [DG330-2P]  (value not drawn)

### Ports
CAMERA_OVERCURRENT_TEST (out), CANH (bidir), CANL (bidir)

### Nets
+3V3: R59.2(B)
+VCAM: VD35.1(K) XP10.1
+VIN: XP7.2
+VLED: XP9.2
CAM_GND: XP10.2
GND: C56.1(A) R71.1(A) XP7.1
LED_GND: XP9.1
NetC56_2: C56.2(B) R71.2(B) VD35.2(K) ; port CAMERA_OVERCURRENT_TEST
NetFU3_2: XP8.2 ; port CANL
NetFU4_2: XP8.1 ; port CANH
NetR59_1: R59.1(A) VD35.3(A)

### Notes on the sheet
- (near XP7) S6 CONNECTOR
- (near XP9) CAM CONNECTOR

### Library data of the parts
C56 = CC0603: Value: 0.1uF
R59 R71 = RC0603
  R59: Value: 4k7
  R71: Value: 100k
VD35 = BAT54A: 1.0 Ampere General Purpose Rectifier; ComponentField6: Published 8-Jun-2000, Modified 11-July-2000: SIM Model Added.; Value: *
XP7-XP10 = DG330-2P: Degson 2 pin connector rear; Value: DG330-2P

## Sheet [15]-MCU_CONNECTORS.SchDoc
size A4
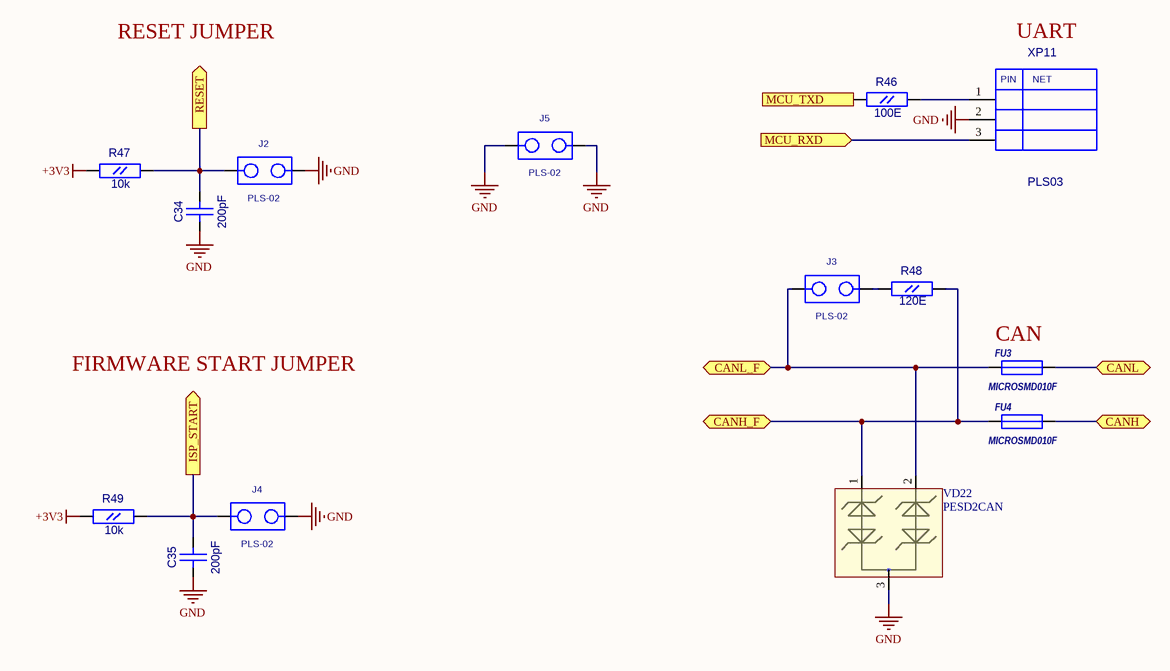
[diagram p11: [15]-MCU_CONNECTORS.SchDoc]

### Parts
C34  200pF  [CC0603]
C35  200pF  [CC0603]
FU3  MICROSMD010F  [RC1210]
FU4  MICROSMD010F  [RC1210]
J2  PLS-02  [PLS-02]
J3  PLS-02  [PLS-02]
J4  PLS-02  [PLS-02]
J5  PLS-02  [PLS-02]
R46  100E  [RC0603]
R47  10k  [RC0603]
R48  120E  [RC0805]
R49  10k  [RC0603]
VD22  PESD2CAN  [SOT-23(123)]
XP11  PLS03  [PLS-03]

### Ports
CANH (bidir), CANH_F (bidir), CANL (bidir), CANL_F (bidir), ISP_START (out), MCU_RXD (in), MCU_TXD (out), RESET (out)

### Nets
+3V3: R47.1(A) R49.1(A)
GND: C34.1(A) C35.1(A) J2.2 J4.2 J5.1 J5.2 VD22.3 XP11.2
CANH: FU4.1 R48.2(B) VD22.1 ; port CANH_F
CANL: FU3.1 J3.1 VD22.2 ; port CANL_F
ISP_START: C35.2(B) J4.1 R49.2(B) ; port ISP_START
MCU_RXD: XP11.3 ; port MCU_RXD
MCU_TXD: R46.1(A) ; port MCU_TXD
RESET: C34.2(B) J2.1 R47.2(B) ; port RESET
NetFU3_2: FU3.2 ; port CANL
NetFU4_2: FU4.2 ; port CANH
NetJ3_2: J3.2 R48.1(A)
NetR46_2: R46.2(B) XP11.1

### Notes on the sheet
- RESET JUMPER
- UART
- FIRMWARE START JUMPER
- (near FU3) CAN
- (in symbol PLS03) PIN; NET

### Library data of the parts
C34 C35 = CC0603: Value: 200pF
FU3 FU4 = MICROSMD: Value: *
R46 R47 R49 = RC0603
  R46: Value: 100E
  R47 R49: Value: 10k
R48 = RC0805: Value: 120E
VD22 = PESD2CAN: TVS for CAN
J2-J5 = PLS-02: Value: *
XP11 = PLS03: Value: *

## Sheet [16]-CLOCK.SchDoc
size A4
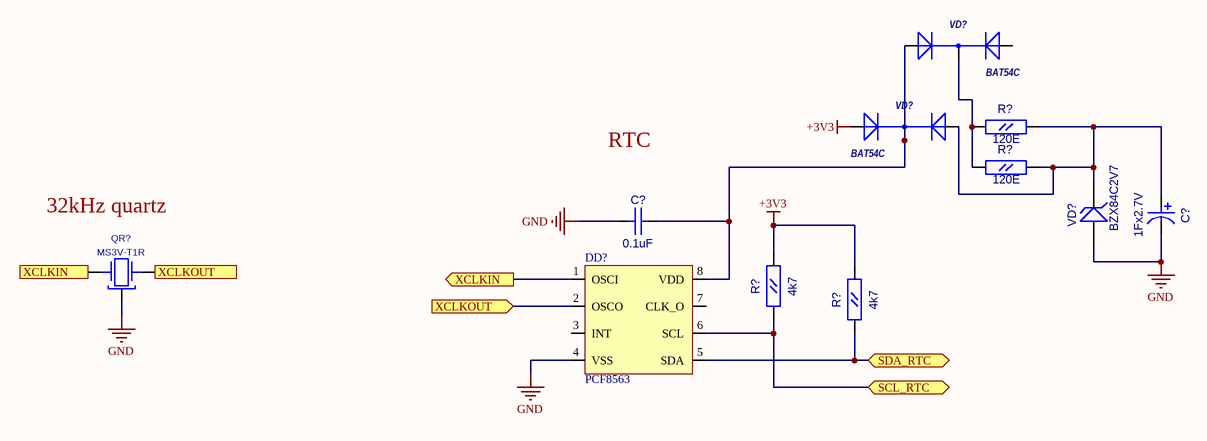
[diagram p12: [16]-CLOCK.SchDoc]

### Parts
(Parts that share a designator on the sheet are numbered #1, #2 ... from top to bottom, then left to right.)
C?#1  1Fx2.7V  [CC8X11.5_L]
C?#2  0.1uF  [CC0603]
DD?  PCF8563  [SO-8]
QR?  MS3V-T1R  [MS3V-T1R]
R?#1  120E  [RC0805]
R?#2  120E  [RC0805]
R?#3  4k7  [RC0603]
R?#4  4k7  [RC0603]
VD?#1  BAT54C  [SOT-23(123)]
VD?#2  BAT54C  [SOT-23(123)]
VD?#3  BZX84C2V7  [SOT-23(123)]

### Ports
SCL_RTC (bidir), SDA_RTC (bidir), XCLKIN (in), XCLKIN (out), XCLKOUT (in), XCLKOUT (out)

### Nets
+3V3: R?#3.2(B) R?#4.2(B) VD?#2.1(A)
GND: C?#1.2 C?#2.1(A) DD?.4(VSS) QR?.3 VD?#3.1(A)
NetC?#1_1: C?#1.1 R?#1.2(B) R?#2.2(B) VD?#2.2(A) VD?#3.3(K)
NetC?#2_2: C?#2.2(B) DD?.8(VDD) VD?#1.1(A) VD?#2.3(K)
NetDD?_1: DD?.1(OSCI) QR?.2(X2) ; port XCLKIN
NetDD?_2: DD?.2(OSCO) QR?.1(X1) ; port XCLKOUT
NetDD?_5: DD?.5(SDA) R?#4.1(A) ; port SDA_RTC
NetDD?_6: DD?.6(SCL) R?#3.1(A) ; port SCL_RTC
NetR?#1_1: R?#1.1(A) R?#2.1(A) VD?#1.3(K)

Not connected (* = marked no-connect by the designer): DD? 3(INT) 7(CLK_O); VD?#1 2(A)

### Notes on the sheet
- RTC
- (near QR?) 32kHz quartz

### Library data of the parts
C?#1 = CAP_8mm: Radial capacitor; Value: 1Fx2.7V
C?#2 = CC0603: Value: 0.1uF
QR? = MS3V-T1R: CRYSTAL_32768 Hz; Value: MS3V-T1R
R?#1 R?#2 = RC0805: Value: 120E
R?#3 R?#4 = RC0603: Value: 4k7
VD?#3 = BZX84: Zener Voltage Regulator Diode; Value: BZX84C2V7
DD? = PCF8563: Value: PCF8563
VD?#1 VD?#2 = BAT54C: Value: *

## Nets that join several sheets
+3V3: [3]-MCU_MAIN (11 pins), [5]-OPI_MAIN (FU1.1 R6.2 R7.2), [8]-GSM_MODEM_CONNECTORS (C20.2 DD1.5 R17.1), [12]-MCU_INPUTS (DA4.8), [14]-MAIN_CONNECTORS (R59.2), [15]-MCU_CONNECTORS (R47.1 R49.1), [16]-CLOCK (R?#3.2 R?#4.2 VD?#2.1)
+4V35: [6]-OPI_POWER (5 pins), [7]-GSM_MODEM_MAIN (C13.1 R14.2 VT3.2), [10]-MAIN_POWER (C25.1 C26.1 L2.2 R21.2), [11]-BATTERY_BACKUP (R25.2 VD7.2)
+5V: [3]-MCU_MAIN (C42.2 DD4.20), [6]-OPI_POWER (9 pins)
+5V_OPI: [5]-OPI_MAIN (XP1.2 XP1.4), [6]-OPI_POWER (VT1.3)
+11V_VCAM: [9]-CAMERA_POWER_CONTROLLER (R52.2 R53.2 VT7.3 VT8.3), [11]-MAIN_POWER2 (VD26.2 VT11.2)
+VCAM: [9]-CAMERA_POWER_CONTROLLER (R50.2 R54.2 VT7.2), [14]-MAIN_CONNECTORS (VD35.1 XP10.1)
+VIN: [10]-MAIN_POWER (FU2.1), [14]-MAIN_CONNECTORS (XP7.2)
+VLED: [9]-CAMERA_POWER_CONTROLLER (R51.2 R55.2 VT8.2), [14]-MAIN_CONNECTORS (XP9.2)
CAM_GND: [9]-CAMERA_POWER_CONTROLLER (VD23.2), [12]-MCU_INPUTS (DA4.3 R31.1), [14]-MAIN_CONNECTORS (XP10.2)
GND: [3]-MCU_MAIN (13 pins), [5]-OPI_MAIN (14 pins), [6]-OPI_POWER (14 pins), [7]-GSM_MODEM_MAIN (16 pins), [8]-GSM_MODEM_CONNECTORS (9 pins), [9]-CAMERA_POWER_CONTROLLER (R50.1 R51.1 VT9.2 VT10.2), [10]-MAIN_POWER (17 pins), [11]-MAIN_POWER2 (15 pins), [11]-BATTERY_BACKUP (C33.1 R58.1 VD8.2), [12]-MCU_INPUTS (7 pins), [14]-MAIN_CONNECTORS (C56.1 R71.1 XP7.1), [15]-MCU_CONNECTORS (8 pins), [16]-CLOCK (5 pins)
LED_GND: [9]-CAMERA_POWER_CONTROLLER (VD24.2), [12]-MCU_INPUTS (DA4.5 R32.1), [14]-MAIN_CONNECTORS (XP9.1)
V_AUX: [7]-GSM_MODEM_MAIN (C11.1 M1.43), [8]-GSM_MODEM_CONNECTORS (C21.2 DD2.5 R16.1)
VIN_F: [10]-MAIN_POWER (C27.2 C28.1 DA3.2 VT5.2), [11]-MAIN_POWER2 (5 pins)
CAM_EN: [5]-OPI_MAIN (XP1.32), [9]-CAMERA_POWER_CONTROLLER (R56.1)
CANH: [3]-MCU_MAIN (DD4.19), [15]-MCU_CONNECTORS (FU4.1 R48.2 VD22.1)
CANL: [3]-MCU_MAIN (DD4.18), [15]-MCU_CONNECTORS (FU3.1 J3.1 VD22.2)
CURRENT_CH_CAM: [3]-MCU_MAIN (DD4.33), [12]-MCU_INPUTS (C15.2 DA4.1 R27.2)
CURRENT_CH_LED: [3]-MCU_MAIN (DD4.34), [12]-MCU_INPUTS (C55.2 DA4.7 R28.2)
ISP_START: [3]-MCU_MAIN (DD4.4), [15]-MCU_CONNECTORS (C35.2 J4.1 R49.2)
LED_EN: [5]-OPI_MAIN (XP1.29), [9]-CAMERA_POWER_CONTROLLER (R57.1)
MCU_RXD: [3]-MCU_MAIN (DD4.46), [5]-OPI_MAIN (XP1.8), [15]-MCU_CONNECTORS (XP11.3)
MCU_TXD: [3]-MCU_MAIN (DD4.47), [5]-OPI_MAIN (XP1.10), [15]-MCU_CONNECTORS (R46.1)
NetC56_2: [5]-OPI_MAIN (XP1.12), [14]-MAIN_CONNECTORS (C56.2 R71.2 VD35.2)
NetDD?_5: [5]-OPI_MAIN (XP1.3), [16]-CLOCK (DD?.5 R?#4.1)
NetDD?_6: [5]-OPI_MAIN (XP1.5), [16]-CLOCK (DD?.6 R?#3.1)
NetFU3_2: [14]-MAIN_CONNECTORS (XP8.2), [15]-MCU_CONNECTORS (FU3.2)
NetFU4_2: [14]-MAIN_CONNECTORS (XP8.1), [15]-MCU_CONNECTORS (FU4.2)
NetR15_2: [5]-OPI_MAIN (XP1.7), [7]-GSM_MODEM_MAIN (R15.2)
OPI_ON: [3]-MCU_MAIN (DD4.36), [6]-OPI_POWER (R12.2)
RESET: [3]-MCU_MAIN (DD4.3), [15]-MCU_CONNECTORS (C34.2 J2.1 R47.2)
RXD: [5]-OPI_MAIN (XP1.11), [8]-GSM_MODEM_CONNECTORS (DD2.4 R17.2)
RXD_buf: [7]-GSM_MODEM_MAIN (M1.8), [8]-GSM_MODEM_CONNECTORS (DD2.2)
SIMCLK: [7]-GSM_MODEM_MAIN (M1.11), [8]-GSM_MODEM_CONNECTORS (C18.2 XP6.3)
SIMIO: [7]-GSM_MODEM_MAIN (M1.12), [8]-GSM_MODEM_CONNECTORS (C16.2 XP6.6)
SIMRST: [7]-GSM_MODEM_MAIN (M1.10), [8]-GSM_MODEM_CONNECTORS (C19.2 XP6.2)
SIMVCC: [7]-GSM_MODEM_MAIN (M1.9), [8]-GSM_MODEM_CONNECTORS (C17.2 XP6.1)
TXD: [5]-OPI_MAIN (XP1.13), [8]-GSM_MODEM_CONNECTORS (DD1.2)
TXD_buf: [7]-GSM_MODEM_MAIN (M1.7), [8]-GSM_MODEM_CONNECTORS (DD1.4 R16.2)